# Altium schematic sheet MARS3.SchDoc
size A3
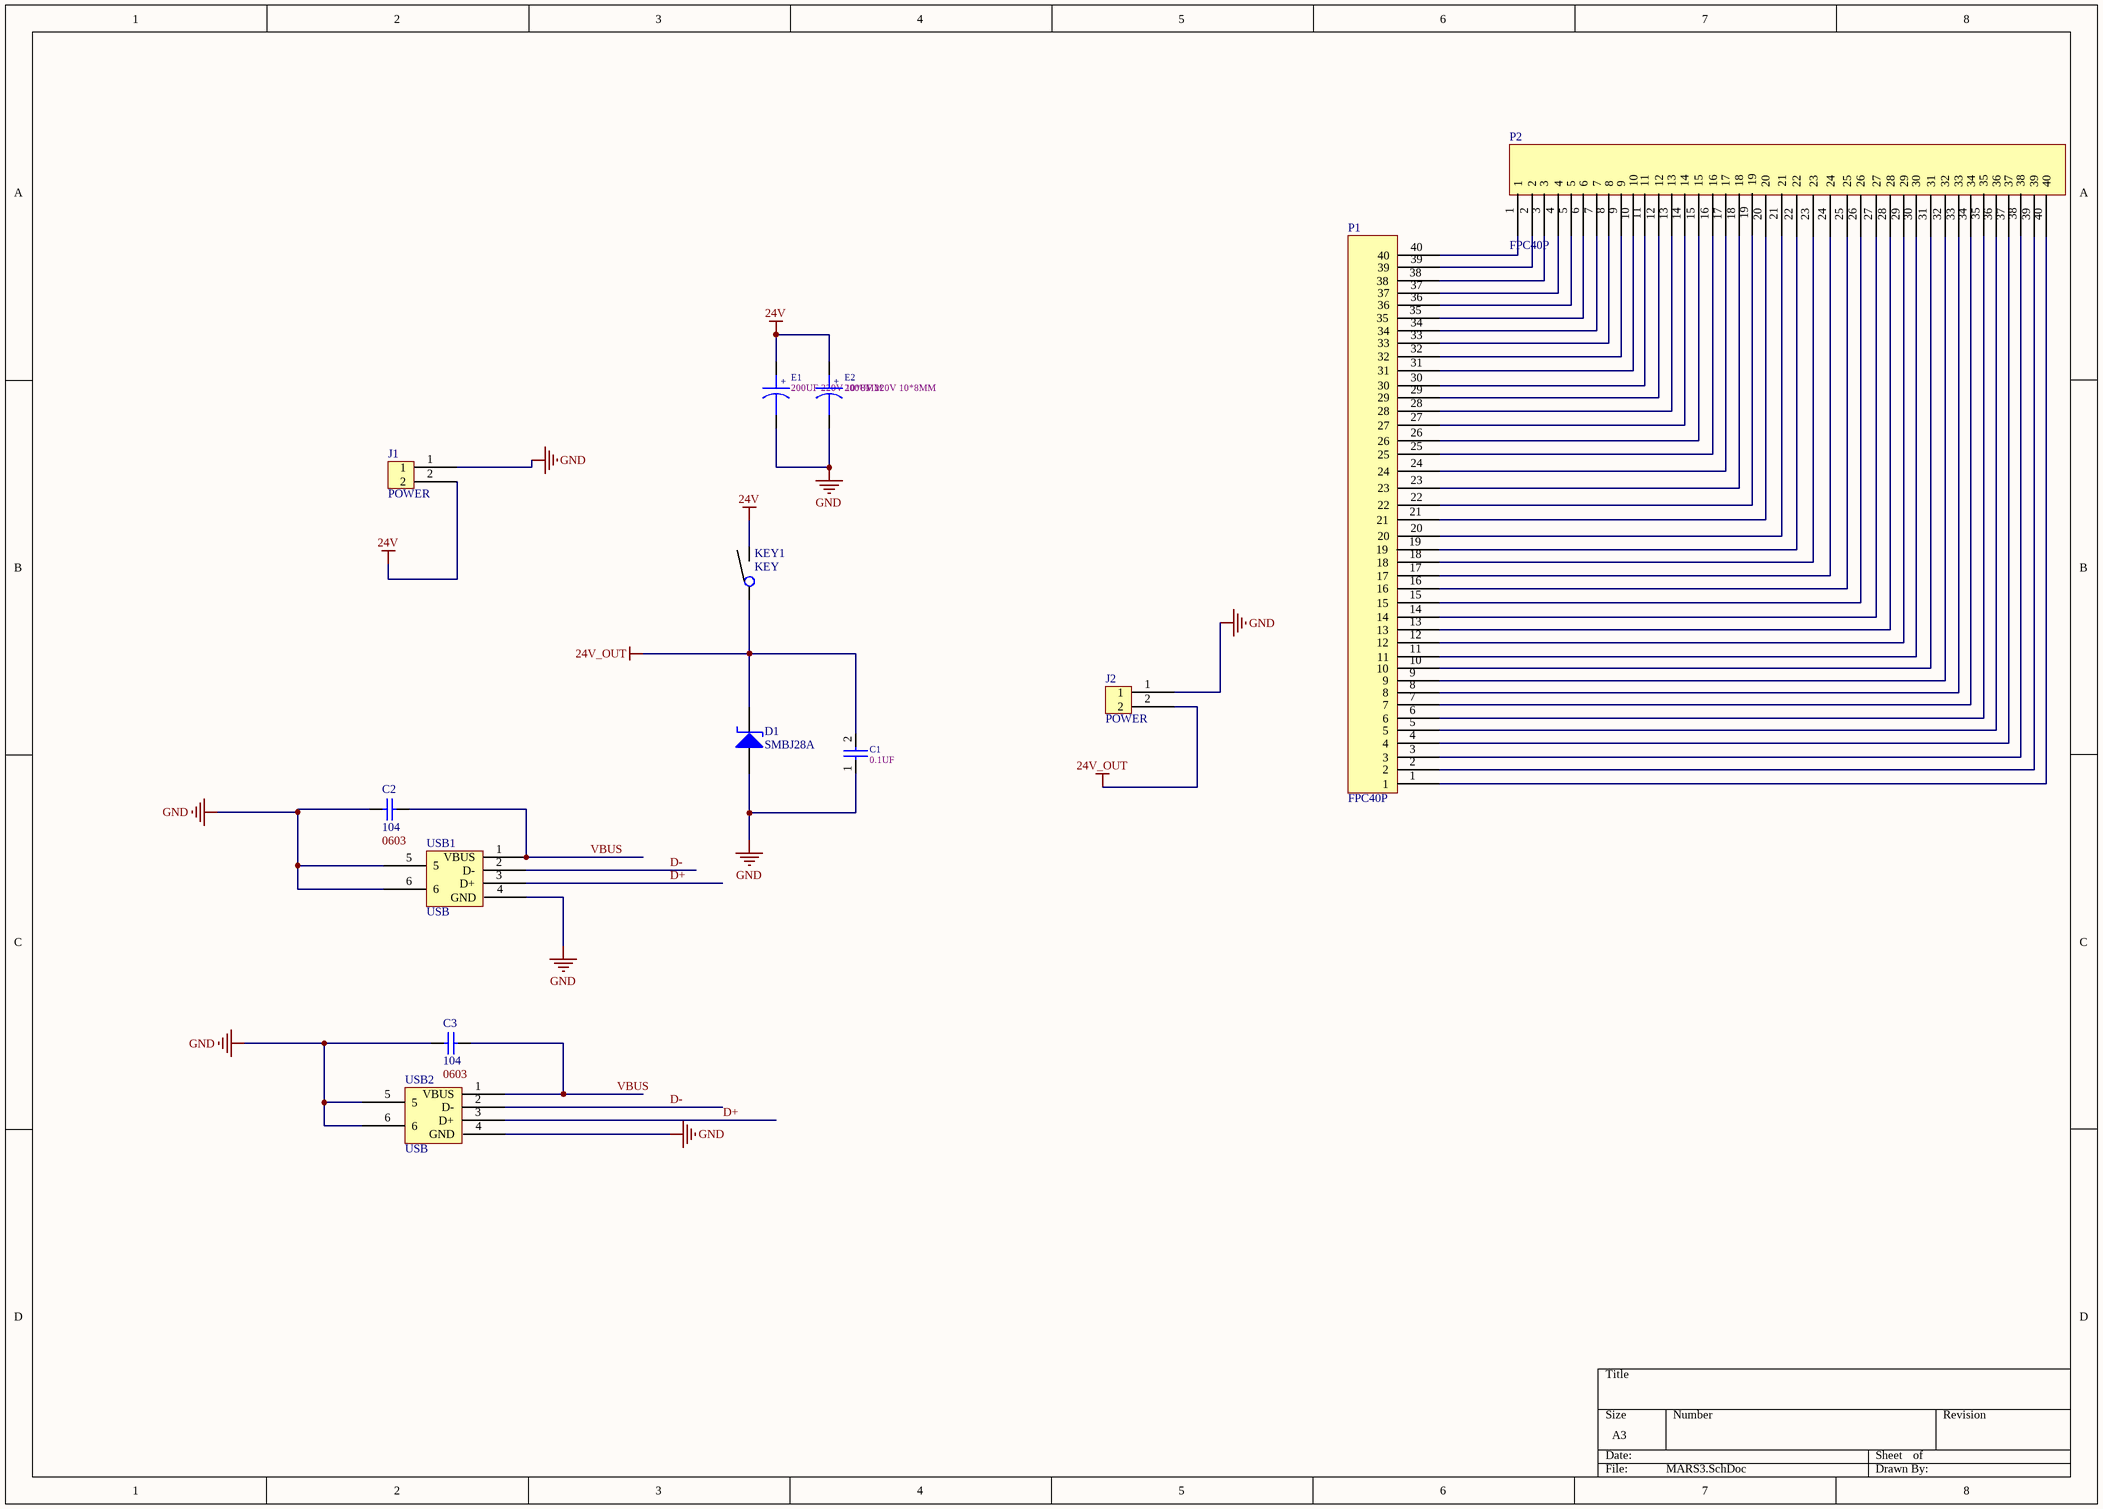
[diagram p0: MARS3.SchDoc]

## Parts
C1  0.1UF  [C0603]
C2  104  Footprint: 0603  [C0603]
C3  104  Footprint: 0603  [C0603]
D1  SMBJ28A  [DO214AA]
E1  200UF 220V 10*8MM  [CAPAE7766X80M]
E2  200UF 220V 10*8MM  [CAPAE7766X80M]
J1  POWER  [VH3.96_2P]
J2  POWER  [VH3.96_2P]
KEY1  KEY  [KEY]
P1  FPC40P  [FPC0.5_40PIN]
P2  FPC40P  [FPC0.5_40PIN]
USB1  USB  [USB_A_90_母座]
USB2  USB  [USB10_SMT]

## Nets
24V: E1.1 E2.1 J1.2 KEY1.2
24V_OUT: C1.2 D1.2(K) J2.2 KEY1.1
GND: C1.1 C2.1 C3.1 D1.1(A) E1.2 E2.2 J1.1 J2.1 USB1.4(GND) USB1.5 USB1.6 USB2.4(GND) USB2.5 USB2.6
D+: USB1.3(D+) USB2.3(D+)
D-: USB1.2(D-) USB2.2(D-)
VBUS: C2.2 C3.2 USB1.1(VBUS) USB2.1(VBUS)
NetP1_1: P1.1 P2.40
NetP1_2: P1.2 P2.39
NetP1_3: P1.3 P2.38
NetP1_4: P1.4 P2.37
NetP1_5: P1.5 P2.36
NetP1_6: P1.6 P2.35
NetP1_7: P1.7 P2.34
NetP1_8: P1.8 P2.33
NetP1_9: P1.9 P2.32
NetP1_10: P1.10 P2.31
NetP1_11: P1.11 P2.30
NetP1_12: P1.12 P2.29
NetP1_13: P1.13 P2.28
NetP1_14: P1.14 P2.27
NetP1_15: P1.15 P2.26
NetP1_16: P1.16 P2.25
NetP1_17: P1.17 P2.24
NetP1_18: P1.18 P2.23
NetP1_19: P1.19 P2.22
NetP1_20: P1.20 P2.21
NetP1_21: P1.21 P2.20
NetP1_22: P1.22 P2.19
NetP1_23: P1.23 P2.18
NetP1_24: P1.24 P2.17
NetP1_25: P1.25 P2.16
NetP1_26: P1.26 P2.15
NetP1_27: P1.27 P2.14
NetP1_28: P1.28 P2.13
NetP1_29: P1.29 P2.12
NetP1_30: P1.30 P2.11
NetP1_31: P1.31 P2.10
NetP1_32: P1.32 P2.9
NetP1_33: P1.33 P2.8
NetP1_34: P1.34 P2.7
NetP1_35: P1.35 P2.6
NetP1_36: P1.36 P2.5
NetP1_37: P1.37 P2.4
NetP1_38: P1.38 P2.3
NetP1_39: P1.39 P2.2
NetP1_40: P1.40 P2.1

## Notes on the sheet
- (in symbol CAPACITOR POL) +

## Library data of the parts
C1 = CAP_10: Capacitor
C2 C3 = Cap_1: Capacitor; Published: 8-Jun-2000; LatestRevisionDate: 17-Jul-2002; LatestRevisionNote: Re-released for DXP Platform.; Publisher: Altium Limited
D1 = TVS
E1 E2 = CAPACITOR POL: Capacitor
J1 J2 = VH3.96_2P
USB1 USB2 = USB_A母头